# EAGLE design CAN_Bus (EAGLE 8.3.1)
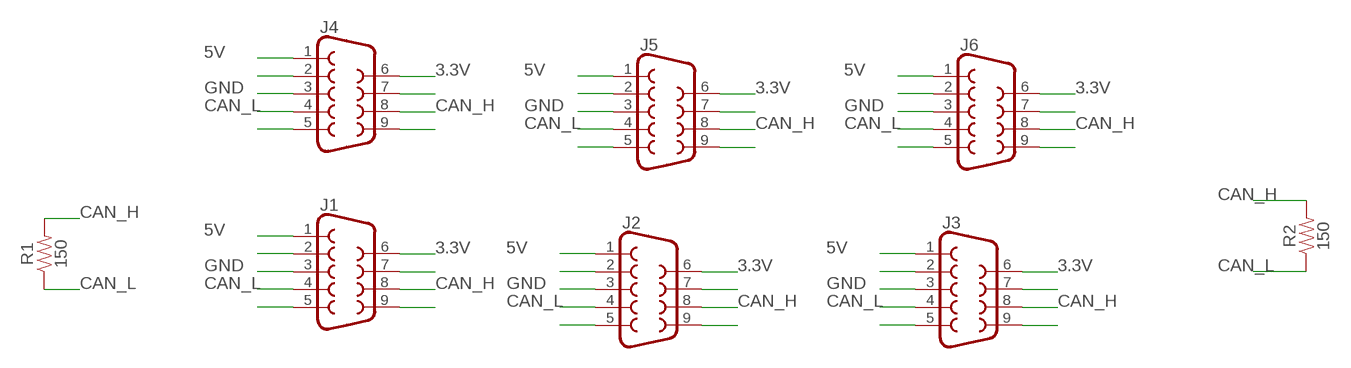
[diagram p0: schematic, sheet 1]

## Parts
J1  DB9FEMALE  [DB9]
J2  DB9FEMALE  [DB9]
J3  DB9FEMALE  [DB9]
J4  DB9FEMALE  [DB9]
J5  DB9FEMALE  [DB9]
J6  DB9FEMALE  [DB9]
R1  150  100OHM-HORIZ-1/4W-1%  [AXIAL-0.3]
R2  150  100OHM-HORIZ-1/4W-1%  [AXIAL-0.3]

## Nets
3.3V: J1.6 J2.6 J3.6 J4.6 J5.6 J6.6
5V: J1.1 J2.1 J3.1 J4.1 J5.1 J6.1
CAN_H: J1.8 J2.8 J3.8 J4.8 J5.8 J6.8 R1.P$2 R2.P$2
CAN_L: J1.4 J2.4 J3.4 J4.4 J5.4 J6.4 R1.P$1 R2.P$1
GND: J1.3 J2.3 J3.3 J4.3 J5.3 J6.3
N$1: J2.5
N$2: J1.5
N$3: J2.2
N$4: J1.2
N$5: J2.7
N$6: J2.9
N$7: J1.7
N$8: J3.5
N$9: J1.9
N$10: J3.2
N$11: J3.7
N$12: J3.9
N$13: J4.5
N$14: J4.2
N$15: J4.7
N$16: J4.9
N$17: J5.5
N$18: J5.2
N$19: J5.7
N$20: J5.9
N$21: J6.5
N$22: J6.2
N$23: J6.7
N$24: J6.9

## Library data of the parts
J1-J6 = SparkFun-Connectors:DB9: DB9 Connector Standard DB9 (D-Sub 9) serial connector. Can be used for CAN bus as well as RS485 and RS232. Footprint production proven. Here is the female version connector we sell at SparkFun: 9 Pin Female Serial Connector - PCB Mount <https://www.sparkfun.com/products/429> (PRT-00429) This connector has been used on the following SparkFun products: SparkFun RS232 Shifter - SMD <https://www.sparkfun.com/products/449> (PRT-00449) SparkFun RS232 Shifter SMD (No DB9) <https://www.sparkfun.com/products/8780> (PRT-08780); PROD_ID: CONN-08194
R1 R2 = SparkFun-Resistors:100OHM: 100Ω resistor A resistor is a passive two-terminal electrical component that implements electrical resistance as a circuit element. Resistors act to reduce current flow, and, at the same time, act to lower voltage levels within circuits. - Wikipedia; PROD_ID: RES-12181; VALUE: 100

## Board
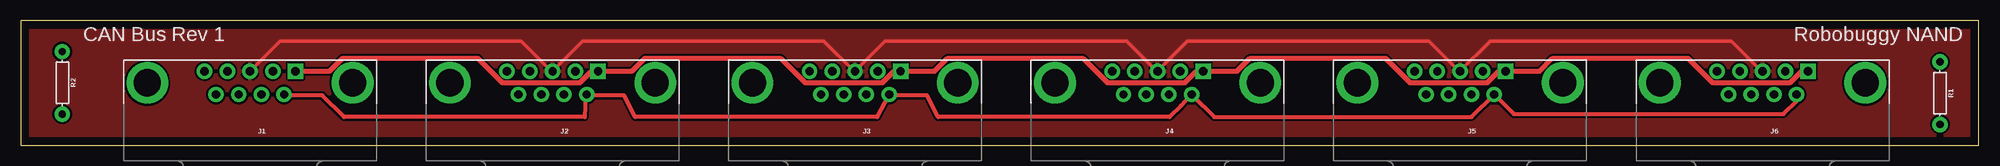
[diagram p1: board, top side]
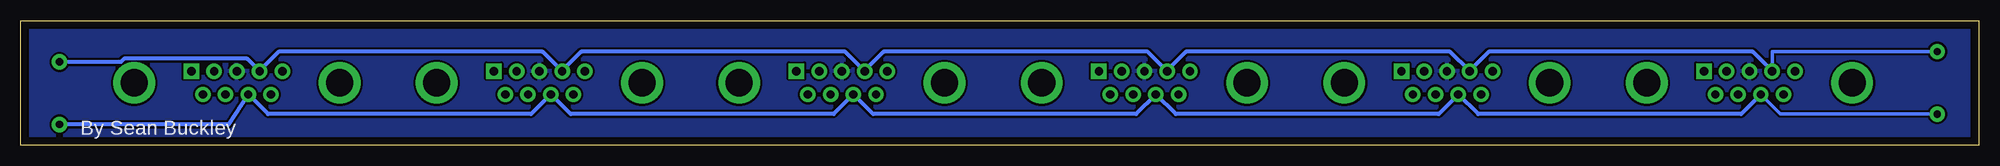
[diagram p2: board, bottom side, seen from below]

Size 238.43 x 15.23 mm. Coordinates in mm from the lower left corner, seen from the top.
Outline: 0,0 238.43,0 238.43,15.23 0,15.23 0,0
Copper layers (1*16): Top 0.035mm / dielectric 1.5mm / Bottom 0.035mm
Design rules "default": minimum track width 6mil, minimum drill 0.35mm, track to track 6mil, track to pad 6mil, pad to pad 6mil, via to via 6mil, smd to smd 6mil, copper to edge 40mil, drill to drill 6mil, minimum pad ring 10mil, minimum via ring 8mil, stop-mask expansion 4mil, vias tented up to drill 0mil, thermal gap 10mil

### Footprints (pad centres in the part's own frame; a part is rotated, then mirrored left to right if it is on the bottom)
DB9 = drill 1.016 pad 1.88 square: 1 -5.54,-1.42 | drill 1.016 pad 1.88: 2 -2.77,-1.42; 3 0,-1.42; 4 2.77,-1.42; 5 5.54,-1.42; 6 -4.15,1.42; 7 -1.38,1.42; 8 1.38,1.42; 9 4.15,1.42 | drill 3.302 pad 5.08: G1 -12.5,0; G2 12.5,0
AXIAL-0.3 = drill 0.9 pad 1.88: P$1 -3.81,0; P$2 3.81,0

### Placement (x,y rotation side)
J1  27.94,7.62 180 top
J2  64.77,7.62 180 top
J3  101.6,7.62 180 top
J4  138.43,7.62 180 top
J5  175.26,7.62 180 top
J6  212.09,7.62 180 top
R1  233.68,6.35 270 top
R2  5.08,7.62 270 top

### Tracks (layer width: path | path; a pad name or v marks a point on that pad's centre or on a via)
3.3V
  Top 0.152: 32.21,6.1 J1.6 | 68.78,6.1 J2.6 68.94,6.1 | 105.82,6.1 J3.6 105.66,6.1 | 179.27,6.1 J5.6 179.43,6.1 | 142.7,6.1 J4.6 | J6.6 216.15,6.25
  Top 0.508: 32.21,6.1 36.73,6.1 39.37,3.45 68.68,3.45 68.78,6.1 | 105.82,6.1 110.34,6.1 111.71,3.45 139.9,3.45 141.28,4.83 J4.6 | 142.7,6.1 145.34,3.45 176.66,3.45 J5.6 | 68.94,6.1 73.46,6.1 74.83,3.45 104.29,3.45 105.66,6.1 | J5.6 179.41,6.01 | J5.6 181.8,3.81 214.63,3.81 216.24,5.42 J6.6
5V
  Top 0.61: J6.1 216.84,9.04 215.44,7.64 205.97,7.64 203,10.62 186.52,10.62 184.94,9.04 J5.1 180.01,9.04 178.61,7.64 169.14,7.64 166.17,10.62 149.69,10.62 148.11,9.04 J4.1 143.18,9.04 141.78,7.64 132.31,7.64 129.34,10.62 112.86,10.62 111.28,9.04 J3.1 106.35,9.04 104.95,7.64 95.48,7.64 92.51,10.62 76.03,10.62 74.45,9.04 J2.1 69.52,9.04 68.12,7.64 58.65,7.64 55.68,10.62 39.2,10.62 37.62,9.04 J1.1
CAN_H
  Bottom 0.406: J1.8 24.17,3.81 R2.P$2
  Bottom 0.508: J1.8 28.95,3.81 60.96,3.81 63.35,6.2 J2.8 65.78,3.81 97.79,3.81 100.18,6.2 J3.8 102.61,3.81 134.62,3.81 137.01,6.2 J4.8 139.44,3.81 171.45,3.81 173.84,6.2 J5.8 176.27,3.81 208.28,3.81 210.67,6.2 J6.8 213.1,2.54 R1.P$2
CAN_L
  Bottom 0.152: 98.96,8.99 J3.4 | 135.53,9.14 J4.4
  Bottom 0.406: J1.4 25.17,11.43 R2.P$1
  Bottom 0.508: J1.4 27.56,11.43 59.69,11.43 62,9.12 J2.4 64.39,11.43 96.52,11.43 98.83,9.12 J3.4 101.22,11.43 133.35,11.43 135.66,9.12 J4.4 138.05,11.43 170.18,11.43 172.49,9.12 J5.4 174.88,11.43 207.01,11.43 209.32,9.12 J6.4 210.85,10.57 225.81,10.57 226.22,10.16 R1.P$1
GND
  Top 0.406: J1.3 31.6,12.7 60.96,12.7 64.62,9.04 J2.3 68.43,12.7 97.79,12.7 101.45,9.04 J3.3 105.26,12.7 134.62,12.7 138.28,9.04 J4.3 142.09,12.7 171.45,12.7 175.11,9.04 J5.3 178.92,12.7 208.28,12.7 211.94,9.04 J6.3
  Bottom 0.152: 27.94,9.14 J1.3 | 64.67,9.14 J2.3 64.82,9.14 | 101.55,9.14 J3.3
  pour Bottom (isolate 0.254): 0,15.24 238.76,15.24 238.76,0 0,0
  pour Top (isolate 0.254): 0,15.24 238.76,15.24 238.76,0 0,0

### Text on the board
tPlace: CAN Bus Rev 1 | Robobuggy NAND
bPlace: By Sean Buckley